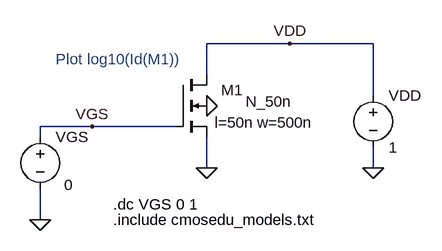
[diagram p0: schematic Fig14_2.asc]
Fig14_2.asc, the LTspice schematic file:
Version 4
SHEET 1 3172 680
WIRE 576 -304 448 -304
WIRE 704 -304 576 -304
WIRE 448 -256 448 -304
WIRE 704 -224 704 -304
WIRE 272 -176 192 -176
WIRE 400 -176 272 -176
WIRE 192 -160 192 -176
WIRE 448 -112 448 -160
WIRE 704 -112 704 -144
WIRE 192 -32 192 -80
FLAG 448 -208 0
FLAG 704 -112 0
FLAG 576 -304 VDD
FLAG 448 -112 0
FLAG 192 -32 0
FLAG 272 -176 VGS
SYMBOL nmos4 400 -256 R0
WINDOW 0 104 24 Right 0
WINDOW 3 179 41 Right 0
WINDOW 123 213 74 Right 0
SYMATTR InstName M1
SYMATTR Value N_50n
SYMATTR Value2 l=50n w=500n
SYMBOL voltage 704 -240 R0
WINDOW 123 0 0 Left 0
WINDOW 39 0 0 Left 0
SYMATTR InstName VDD
SYMATTR Value 1
SYMBOL voltage 192 -176 R0
WINDOW 3 37 90 Left 0
WINDOW 123 0 0 Left 0
WINDOW 39 0 0 Left 0
SYMATTR Value 0
SYMATTR InstName VGS
TEXT 304 -56 Left 0 !.dc VGS 0 1 
TEXT 304 -32 Left 0 !.include cmosedu_models.txt
TEXT 216 -280 Left 0 ;Plot log10(Id(M1))

The netlist it stands for:
* Fig14_2.asc
M1 VDD VGS 0 0 N_50n l=50n w=500n
VDD VDD 0 1
VGS VGS 0 0
.model NMOS NMOS
.model PMOS PMOS
.lib standard.mos
.dc VGS 0 1
.include cmosedu_models.txt
* Plot log10(Id(M1))
.backanno
.end